# Altium schematic sheet mini_backplane.SchDoc
size A3
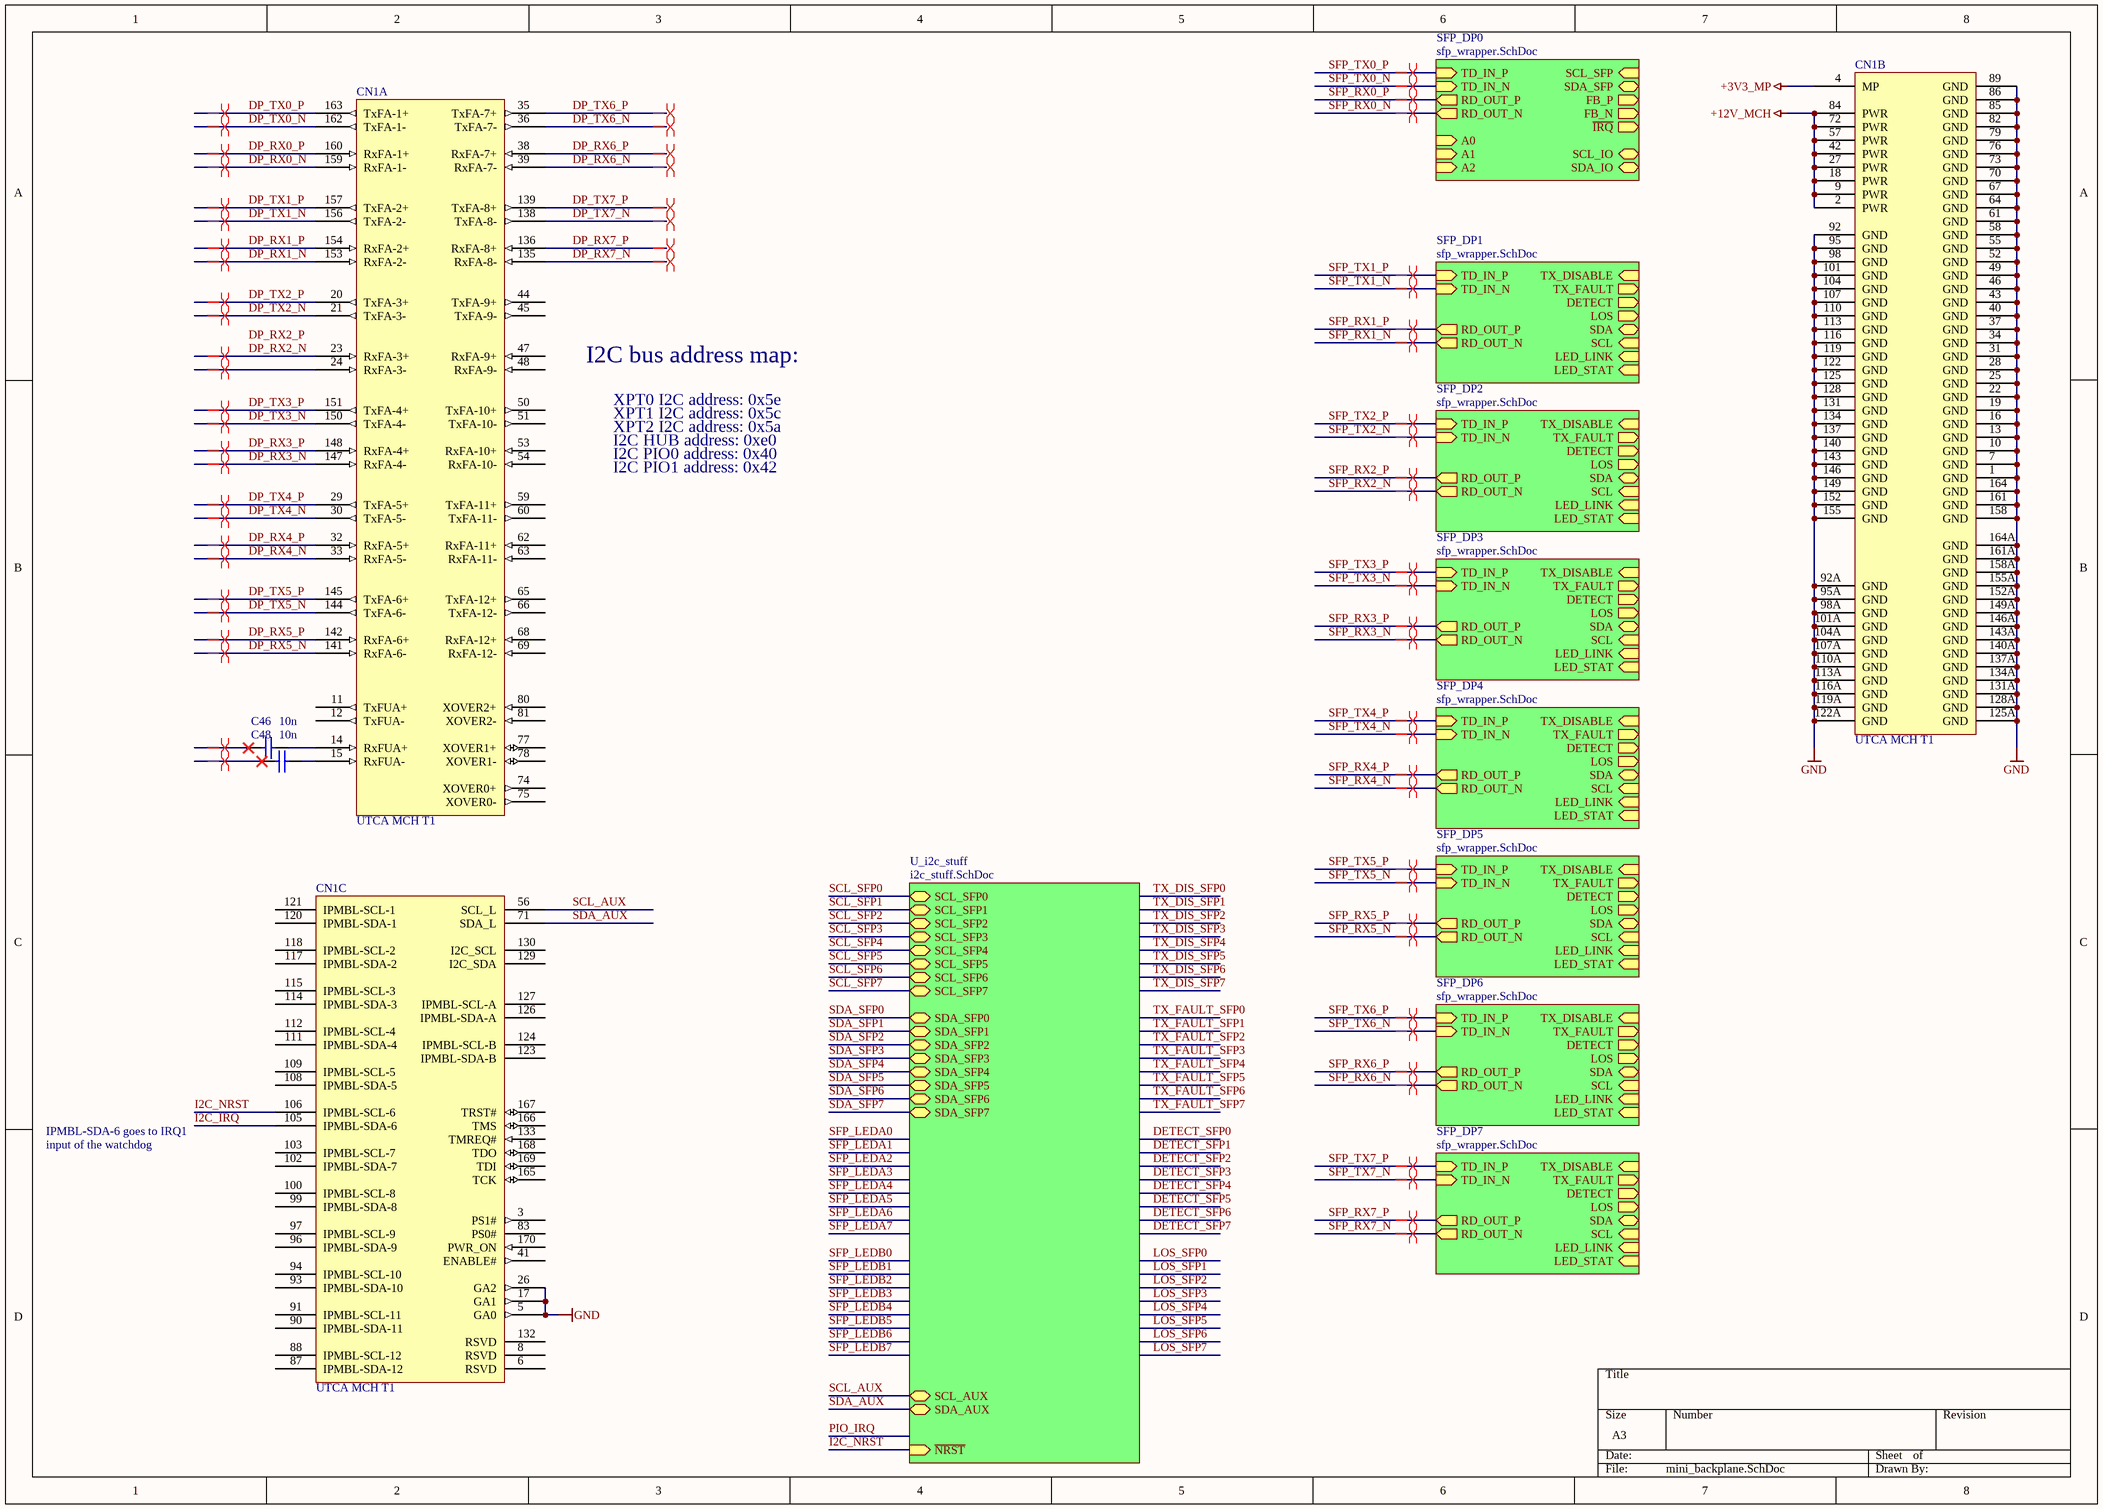
[diagram p0: mini_backplane.SchDoc]

## Parts
C46  10n  [CAPC1608X87N]
C48  10n  [CAPC1608X87N]
CN1  UTCA MCH T1  [CON_AMC_MOLEX_75800_00001_REVERSE]  (parts A,B,C of 3)

## Sub-sheets
SFP_DP0 = sfp_wrapper.SchDoc: RD_OUT_N (out), RD_OUT_P (out), TD_IN_N (in), TD_IN_P (in), SDA_SFP (bidir), SCL_SFP (in), FB_P (out), FB_N (out), ~{IRQ} (out), A0 (in), A1 (in), A2 (in), SCL_IO (bidir), SDA_IO (bidir)
SFP_DP1 = sfp_wrapper.SchDoc: TX_FAULT (out), TX_DISABLE (in), SDA (bidir), SCL (in), DETECT (out), LOS (out), RD_OUT_N (out), RD_OUT_P (out), TD_IN_N (in), TD_IN_P (in), LED_LINK (in), LED_STAT (in)
SFP_DP2 = sfp_wrapper.SchDoc: TX_FAULT (out), TX_DISABLE (in), SDA (bidir), SCL (in), DETECT (out), LOS (out), RD_OUT_N (out), RD_OUT_P (out), TD_IN_N (in), TD_IN_P (in), LED_LINK (in), LED_STAT (in)
SFP_DP3 = sfp_wrapper.SchDoc: TX_FAULT (out), TX_DISABLE (in), SDA (bidir), SCL (in), DETECT (out), LOS (out), RD_OUT_N (out), RD_OUT_P (out), TD_IN_N (in), TD_IN_P (in), LED_LINK (in), LED_STAT (in)
SFP_DP4 = sfp_wrapper.SchDoc: TX_FAULT (out), TX_DISABLE (in), SDA (bidir), SCL (in), DETECT (out), LOS (out), RD_OUT_N (out), RD_OUT_P (out), TD_IN_N (in), TD_IN_P (in), LED_LINK (in), LED_STAT (in)
SFP_DP5 = sfp_wrapper.SchDoc: TX_FAULT (out), TX_DISABLE (in), SDA (bidir), SCL (in), DETECT (out), LOS (out), RD_OUT_N (out), RD_OUT_P (out), TD_IN_N (in), TD_IN_P (in), LED_LINK (in), LED_STAT (in)
SFP_DP6 = sfp_wrapper.SchDoc: TX_FAULT (out), TX_DISABLE (in), SDA (bidir), SCL (in), DETECT (out), LOS (out), RD_OUT_N (out), RD_OUT_P (out), TD_IN_N (in), TD_IN_P (in), LED_LINK (in), LED_STAT (in)
SFP_DP7 = sfp_wrapper.SchDoc: TX_FAULT (out), TX_DISABLE (in), SDA (bidir), SCL (in), DETECT (out), LOS (out), RD_OUT_N (out), RD_OUT_P (out), TD_IN_N (in), TD_IN_P (in), LED_LINK (in), LED_STAT (in)
U_i2c_stuff = i2c_stuff.SchDoc: SCL_SFP0 (bidir), SCL_SFP1 (bidir), SCL_SFP2 (bidir), SCL_SFP3 (bidir), SCL_SFP4 (bidir), SCL_SFP5 (bidir), SCL_SFP6 (bidir), SCL_SFP7 (bidir), SDA_SFP0 (bidir), SDA_SFP1 (bidir), SDA_SFP2 (bidir), SDA_SFP3 (bidir), SDA_SFP4 (bidir), SDA_SFP5 (bidir), SDA_SFP6 (bidir), SDA_SFP7 (bidir), SCL_AUX (bidir), SDA_AUX (bidir), ~{NRST} (in)

## Nets
+3V3_MP: CN1.4(MP)
+12V_MCH: CN1.2(PWR) CN1.9(PWR) CN1.18(PWR) CN1.27(PWR) CN1.42(PWR) CN1.57(PWR) CN1.72(PWR) CN1.84(PWR)
GND: CN1.1(GND) CN1.5(GA0) CN1.7(GND) CN1.10(GND) CN1.13(GND) CN1.16(GND) CN1.17(GA1) CN1.19(GND) CN1.22(GND) CN1.25(GND) CN1.26(GA2) CN1.28(GND) CN1.31(GND) CN1.34(GND) CN1.37(GND) CN1.40(GND) CN1.43(GND) CN1.46(GND) CN1.49(GND) CN1.52(GND) CN1.55(GND) CN1.58(GND) CN1.61(GND) CN1.64(GND) CN1.67(GND) CN1.70(GND) CN1.73(GND) CN1.76(GND) CN1.79(GND) CN1.82(GND) CN1.85(GND) CN1.86(GND) CN1.89(GND) CN1.92(GND) CN1.92A(GND) CN1.95(GND) CN1.95A(GND) CN1.98(GND) CN1.98A(GND) CN1.101(GND) CN1.101A(GND) CN1.104(GND) CN1.104A(GND) CN1.107(GND) CN1.107A(GND) CN1.110(GND) CN1.110A(GND) CN1.113(GND) CN1.113A(GND) CN1.116(GND) CN1.116A(GND) CN1.119(GND) CN1.119A(GND) CN1.122(GND) CN1.122A(GND) CN1.125(GND) CN1.125A(GND) CN1.128(GND) CN1.128A(GND) CN1.131(GND) CN1.131A(GND) CN1.134(GND) CN1.134A(GND) CN1.137(GND) CN1.137A(GND) CN1.140(GND) CN1.140A(GND) CN1.143(GND) CN1.143A(GND) CN1.146(GND) CN1.146A(GND) CN1.149(GND) CN1.149A(GND) CN1.152(GND) CN1.152A(GND) CN1.155(GND) CN1.155A(GND) CN1.158(GND) CN1.158A(GND) CN1.161(GND) CN1.161A(GND) CN1.164(GND) CN1.164A(GND)
DP_RX0_N: CN1.159(RxFA-1-)
DP_RX0_P: CN1.160(RxFA-1+)
DP_RX1_N: CN1.153(RxFA-2-)
DP_RX1_P: CN1.154(RxFA-2+)
DP_RX2_N: CN1.23(RxFA-3+)
DP_RX3_N: CN1.147(RxFA-4-)
DP_RX3_P: CN1.148(RxFA-4+)
DP_RX4_N: CN1.33(RxFA-5-)
DP_RX4_P: CN1.32(RxFA-5+)
DP_RX5_N: CN1.141(RxFA-6-)
DP_RX5_P: CN1.142(RxFA-6+)
DP_RX6_N: CN1.39(RxFA-7-)
DP_RX6_P: CN1.38(RxFA-7+)
DP_RX7_N: CN1.135(RxFA-8-)
DP_RX7_P: CN1.136(RxFA-8+)
DP_TX0_N: CN1.162(TxFA-1-)
DP_TX0_P: CN1.163(TxFA-1+)
DP_TX1_N: CN1.156(TxFA-2-)
DP_TX1_P: CN1.157(TxFA-2+)
DP_TX2_N: CN1.21(TxFA-3-)
DP_TX2_P: CN1.20(TxFA-3+)
DP_TX3_N: CN1.150(TxFA-4-)
DP_TX3_P: CN1.151(TxFA-4+)
DP_TX4_N: CN1.30(TxFA-5-)
DP_TX4_P: CN1.29(TxFA-5+)
DP_TX5_N: CN1.144(TxFA-6-)
DP_TX5_P: CN1.145(TxFA-6+)
DP_TX6_N: CN1.36(TxFA-7-)
DP_TX6_P: CN1.35(TxFA-7+)
DP_TX7_N: CN1.138(TxFA-8-)
DP_TX7_P: CN1.139(TxFA-8+)
I2C_IRQ: CN1.105(IPMBL-SDA-6)
I2C_NRST: CN1.106(IPMBL-SCL-6) ; sheet U_i2c_stuff/~{NRST}
SCL_AUX: CN1.56(SCL_L) ; sheet U_i2c_stuff/SCL_AUX
SCL_SFP0: sheet U_i2c_stuff/SCL_SFP0
SCL_SFP1: sheet U_i2c_stuff/SCL_SFP1
SCL_SFP2: sheet U_i2c_stuff/SCL_SFP2
SCL_SFP3: sheet U_i2c_stuff/SCL_SFP3
SCL_SFP4: sheet U_i2c_stuff/SCL_SFP4
SCL_SFP5: sheet U_i2c_stuff/SCL_SFP5
SCL_SFP6: sheet U_i2c_stuff/SCL_SFP6
SCL_SFP7: sheet U_i2c_stuff/SCL_SFP7
SDA_AUX: CN1.71(SDA_L) ; sheet U_i2c_stuff/SDA_AUX
SDA_SFP0: sheet U_i2c_stuff/SDA_SFP0
SDA_SFP1: sheet U_i2c_stuff/SDA_SFP1
SDA_SFP2: sheet U_i2c_stuff/SDA_SFP2
SDA_SFP3: sheet U_i2c_stuff/SDA_SFP3
SDA_SFP4: sheet U_i2c_stuff/SDA_SFP4
SDA_SFP5: sheet U_i2c_stuff/SDA_SFP5
SDA_SFP6: sheet U_i2c_stuff/SDA_SFP6
SDA_SFP7: sheet U_i2c_stuff/SDA_SFP7
SFP_RX0_N: sheet SFP_DP0/RD_OUT_N
SFP_RX0_P: sheet SFP_DP0/RD_OUT_P
SFP_RX1_N: sheet SFP_DP1/RD_OUT_N
SFP_RX1_P: sheet SFP_DP1/RD_OUT_P
SFP_RX2_N: sheet SFP_DP2/RD_OUT_N
SFP_RX2_P: sheet SFP_DP2/RD_OUT_P
SFP_RX3_N: sheet SFP_DP3/RD_OUT_N
SFP_RX3_P: sheet SFP_DP3/RD_OUT_P
SFP_RX4_N: sheet SFP_DP4/RD_OUT_N
SFP_RX4_P: sheet SFP_DP4/RD_OUT_P
SFP_RX5_N: sheet SFP_DP5/RD_OUT_N
SFP_RX5_P: sheet SFP_DP5/RD_OUT_P
SFP_RX6_N: sheet SFP_DP6/RD_OUT_N
SFP_RX6_P: sheet SFP_DP6/RD_OUT_P
SFP_RX7_N: sheet SFP_DP7/RD_OUT_N
SFP_RX7_P: sheet SFP_DP7/RD_OUT_P
SFP_TX0_N: sheet SFP_DP0/TD_IN_N
SFP_TX0_P: sheet SFP_DP0/TD_IN_P
SFP_TX1_N: sheet SFP_DP1/TD_IN_N
SFP_TX1_P: sheet SFP_DP1/TD_IN_P
SFP_TX2_N: sheet SFP_DP2/TD_IN_N
SFP_TX2_P: sheet SFP_DP2/TD_IN_P
SFP_TX3_N: sheet SFP_DP3/TD_IN_N
SFP_TX3_P: sheet SFP_DP3/TD_IN_P
SFP_TX4_N: sheet SFP_DP4/TD_IN_N
SFP_TX4_P: sheet SFP_DP4/TD_IN_P
SFP_TX5_N: sheet SFP_DP5/TD_IN_N
SFP_TX5_P: sheet SFP_DP5/TD_IN_P
SFP_TX6_N: sheet SFP_DP6/TD_IN_N
SFP_TX6_P: sheet SFP_DP6/TD_IN_P
SFP_TX7_N: sheet SFP_DP7/TD_IN_N
SFP_TX7_P: sheet SFP_DP7/TD_IN_P
NetC46_2: C46.2 CN1.14(RxFUA+)
NetC48_2: C48.2 CN1.15(RxFUA-)

Not connected (* = marked no-connect by the designer): C46 1*; C48 1*; CN1 3(PS1#) 6(RSVD) 8(RSVD) 11(TxFUA+) 12(TxFUA-) 24(RxFA-3-) 41(ENABLE#) 44(TxFA-9+) 45(TxFA-9-) 47(RxFA-9+) 48(RxFA-9-) 50(TxFA-10+) 51(TxFA-10-) 53(RxFA-10+) 54(RxFA-10-) 59(TxFA-11+) 60(TxFA-11-) 62(RxFA-11+) 63(RxFA-11-) 65(TxFA-12+) 66(TxFA-12-) 68(RxFA-12+) 69(RxFA-12-) 74(XOVER0+) 75(XOVER0-) 77(XOVER1+) 78(XOVER1-) 80(XOVER2+) 81(XOVER2-) 83(PS0#) 87(IPMBL-SDA-12) 88(IPMBL-SCL-12) 90(IPMBL-SDA-11) 91(IPMBL-SCL-11) 93(IPMBL-SDA-10) 94(IPMBL-SCL-10) 96(IPMBL-SDA-9) 97(IPMBL-SCL-9) 99(IPMBL-SDA-8) 100(IPMBL-SCL-8) 102(IPMBL-SDA-7) 103(IPMBL-SCL-7) 108(IPMBL-SDA-5) 109(IPMBL-SCL-5) 111(IPMBL-SDA-4) 112(IPMBL-SCL-4) 114(IPMBL-SDA-3) 115(IPMBL-SCL-3) 117(IPMBL-SDA-2) 118(IPMBL-SCL-2) 120(IPMBL-SDA-1) 121(IPMBL-SCL-1) 123(IPMBL-SDA-B) 124(IPMBL-SCL-B) 126(IPMBL-SDA-A) 127(IPMBL-SCL-A) 129(I2C_SDA) 130(I2C_SCL) 132(RSVD) 133(TMREQ#) 165(TCK) 166(TMS) 167(TRST#) 168(TDO) 169(TDI) 170(PWR_ON)

## Layout directives
differential pair: DP_RX0_N, DP_RX0_P, DP_RX1_N, DP_RX1_P, DP_RX2_N, DP_RX3_N, DP_RX3_P, DP_RX4_N, DP_RX4_P, DP_RX5_N, DP_RX5_P, DP_RX6_N, DP_RX6_P, DP_RX7_N, DP_RX7_P, DP_TX0_N, DP_TX0_P, DP_TX1_N, DP_TX1_P, DP_TX2_N, DP_TX2_P, DP_TX3_N, DP_TX3_P, DP_TX4_N, DP_TX4_P, DP_TX5_N, DP_TX5_P, DP_TX6_N, DP_TX6_P, DP_TX7_N, DP_TX7_P, NetC46_1, NetC48_1, NetCN1_24, SFP_RX0_N, SFP_RX0_P, SFP_RX1_N, SFP_RX1_P, SFP_RX2_N, SFP_RX2_P, SFP_RX3_N, SFP_RX3_P, SFP_RX4_N, SFP_RX4_P, SFP_RX5_N, SFP_RX5_P, SFP_RX6_N, SFP_RX6_P, SFP_RX7_N, SFP_RX7_P, SFP_TX0_N, SFP_TX0_P, SFP_TX1_N, SFP_TX1_P, SFP_TX2_N, SFP_TX2_P, SFP_TX3_N, SFP_TX3_P, SFP_TX4_N, SFP_TX4_P, SFP_TX5_N, SFP_TX5_P, SFP_TX6_N, SFP_TX6_P, SFP_TX7_N, SFP_TX7_P

## Notes on the sheet
- I2C bus address map:
- XPT0 I2C address: 0x5e
- XPT1 I2C address: 0x5c
- XPT2 I2C address: 0x5a
- I2C HUB address: 0xe0
- I2C PIO0 address: 0x40
- I2C PIO1 address: 0x42
- IPMBL-SDA-6 goes to IRQ1
- input of the watchdog
- Labels drawn without touching a wire or pin: DP_RX2_P

## Library data of the parts
C46 C48 = CC0603_10NF_50V_10%_X7R: Non-polarised capacitor; Part Description: SMD Multilayer Chip Ceramic Capacitor; Manufacturer: GENERIC; Manufacturer1 Part Number: 223858615636; Value: 10nF; Voltage: 50V; TC: X7R; Tolerance: ±10%; Table: Capacitors SMD; Part Number: CC0603_10NF_50V_10%_X7R; Component Kind: Standard; Component Type: Standard; Pin Count: 2; Status: Preferred; Manufacturer Part Number: CC0603_10NF_50V_10%_X7R; Case: 0603; Mounted: Yes; Socket: No; SMD: Yes; Manufacturer1 Example: PHYCOMP; Manufacturer1 ComponentHeight: 0.87mm; HelpURL: \\cern.ch\dfs\Applications\Altium\Datasheets\CC0603_X7R_PHYCOMP.pdf; Author: CERN DEM JLC; CreateDate: 12/3/2007; LatestRevisionDate: 12/3/2007
CN1 = UTCA_MCH_SOCKET: microTCA MTCA.0  MCH socket (AMC0.0 B+ connector with reversed pins); Value: MCH tongue 1; Value: MOLEX 75800-00001; RefId: 1353569; Supplier: Farnell